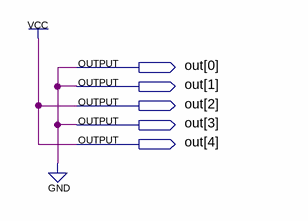
[diagram p0: schematic sheet]
// Quartus schematic constUserYTop.bdf as structural Verilog: 0 symbols, 5 pins
module constUserYTop (
  output [4:0] out
);


  assign out = 5'b10100;
endmodule
